# EasyEDA schematic SCH_AC400-Controller_2024-06-21.json
TITLE: Sheet_1; REV: 1.0; Date: 2021-10-31; Sheet: 1/1; Drawn By: Andrey Kharitonkin; Company: Your Company
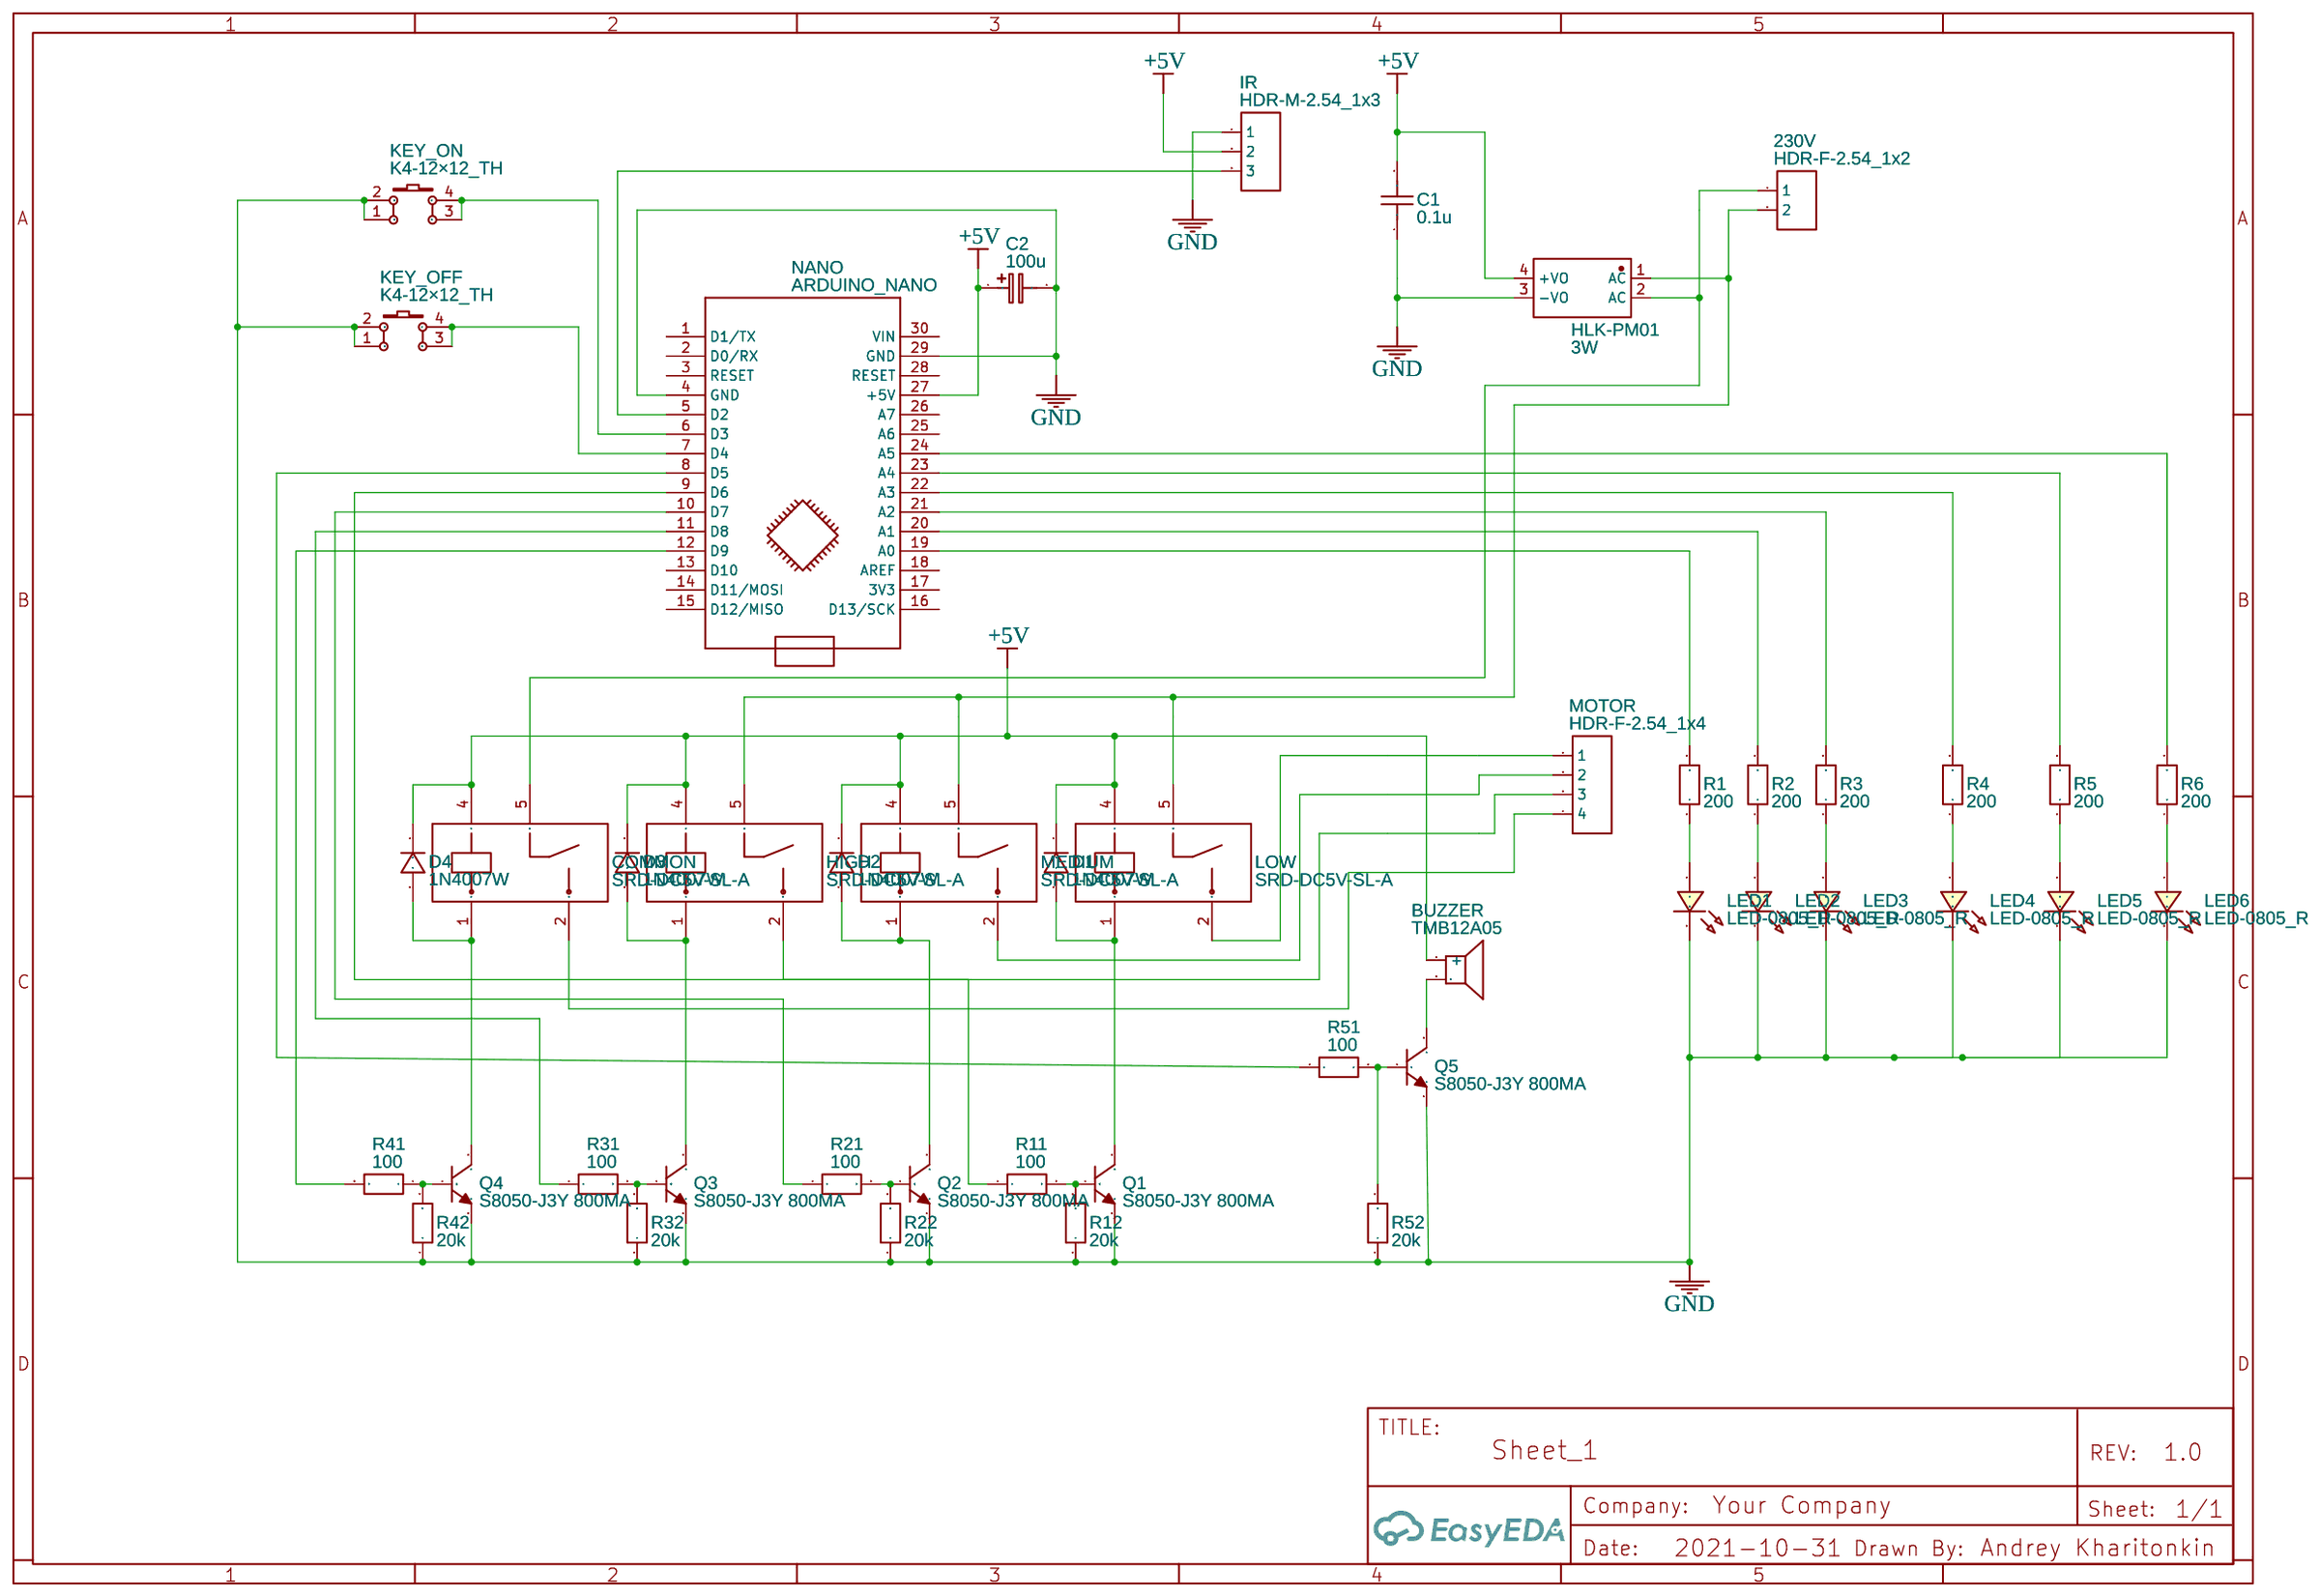
[diagram p0: schematic sheet]

## Parts
3W  HLK-PM01  [PWRM-TH_HLK-PM01]
230V  HDR-F-2.54_1x2  [CONN-TH_3(2)P-P3.96_B3PS-VH]
BUZZER  TMB12A05  [BUZ-TH_BD12.0-P7.60-D0.6-FD]
C1  0.1u  [C0805]
C2  100u  [CAP-D6.3×F2.5]
COMMON  SRD-DC5V-SL-A  [RELAY-TH_SRD-DCXXV-SL-A]
D1  1N4007W  [SOD-123_L2.8-W1.8-LS3.7-RD]
D2  1N4007W  [SOD-123_L2.8-W1.8-LS3.7-RD]
D3  1N4007W  [SOD-123_L2.8-W1.8-LS3.7-RD]
D4  1N4007W  [SOD-123_L2.8-W1.8-LS3.7-RD]
HIGH  SRD-DC5V-SL-A  [RELAY-TH_SRD-DCXXV-SL-A]
IR  HDR-M-2.54_1x3  [HDR-M-2.54_1X3]
KEY_OFF  K4-12×12_TH  [KEY-TH_4P-L12.0-W12.0-P5.00-LS12.5]
KEY_ON  K4-12×12_TH  [KEY-TH_4P-L12.0-W12.0-P5.00-LS12.5]
LED1  LED-0805_R  [LED1206-FD_GREEN]
LED2  LED-0805_R  [LED1206-FD_GREEN]
LED3  LED-0805_R  [LED1206-FD_GREEN]
LED4  LED-0805_R  [LED1206-FD_GREEN]
LED5  LED-0805_R  [LED1206-FD_GREEN]
LED6  LED-0805_R  [LED1206-FD_GREEN]
LOW  SRD-DC5V-SL-A  [RELAY-TH_SRD-DCXXV-SL-A]
MEDIUM  SRD-DC5V-SL-A  [RELAY-TH_SRD-DCXXV-SL-A]
MOTOR  HDR-F-2.54_1x4  [CONN-TH_7(4)P-P3.96_B3PS-VH]
NANO  ARDUINO_NANO  [ARDUINO_NANO]
Q1  S8050-J3Y 800MA  [SOT-23-3_L2.9-W1.6-P1.90-LS2.8-BR]
Q2  S8050-J3Y 800MA  [SOT-23-3_L2.9-W1.6-P1.90-LS2.8-BR]
Q3  S8050-J3Y 800MA  [SOT-23-3_L2.9-W1.6-P1.90-LS2.8-BR]
Q4  S8050-J3Y 800MA  [SOT-23-3_L2.9-W1.6-P1.90-LS2.8-BR]
Q5  S8050-J3Y 800MA  [SOT-23-3_L2.9-W1.6-P1.90-LS2.8-BR]
R1  200  [R0805]
R2  200  [R0805]
R3  200  [R0805]
R4  200  [R0805]
R5  200  [R0805]
R6  200  [R0805]
R11  100  [R0805]
R12  20k  [R0805]
R21  100  [R0805]
R22  20k  [R0805]
R31  100  [R0805]
R32  20k  [R0805]
R41  100  [R0805]
R42  20k  [R0805]
R51  100  [R0805]
R52  20k  [R0805]

## Library data of the parts
3W = HLK-PM01: Supplier: LCSC; Supplier Part: C209903; Manufacturer: HI-LINK; Contributor: LCSC; JLCPCB Part Class: Extended Part
230V = HDR-F-2.54_1x2: Supplier Part: C49661; Supplier: LCSC; Contributor: LCEDA_Lib
BUZZER = TMB12A05: Supplier: LCSC; Manufacturer: HNDZ; Supplier Part: C96093; JLCPCB Part Class: Extended Part
C1 = C_1206_US: Supplier Part: C126469; Supplier: LCSC; Contributor: LCEDA_Lib; Manufacturer Part: CT41G-0805-2X1-50V-0.1uF-K(N); Manufacturer: TORCH
C2 = CE_TH_D6.3×F2.5_EU: Contributor: LCEDA_Lib
COMMON HIGH LOW MEDIUM = SRD-DC5V-SL-A: Supplier: LCSC; Supplier Part: C688861; Manufacturer: Ningbo Songle Relay; Contributor: LCSC; JLCPCB Part Class: Extended Part
D1-D4 = 1N4007W: Supplier: LCSC; Supplier Part: C328592; Manufacturer: BLUE ROCKET; Contributor: LCEDA_Lib
IR = HDR-M-2.54_1x3: Supplier Part: C180248; Supplier: LCSC; Contributor: LCEDA_Lib
KEY_OFF KEY_ON = K4-12×12_TH: Supplier Part: C128053; Supplier: LCSC; Manufacturer: 韩国韩荣; Manufacturer Part: K2-1103DP-M4SW-04; Contributor: LCEDA_Lib
LED1-LED6 = LED-0805_R: Manufacturer: EVERLIGHT(台湾亿光); Manufacturer Part: 17-21SURC/S530-A3/TR8; Supplier Part: C72037; Contributor: LCEDA_Lib
MOTOR = HDR-F-2.54_1x4: Supplier Part: C225501; Supplier: LCSC; Contributor: LCEDA_Lib
NANO = -: sourceId: KGSeAWhDB; Manufacturer Part: ?
Q1-Q5 = S8050-J3Y 800MA: Supplier: LCSC; Supplier Part: C2848180; Manufacturer: IDCHIP(英锐芯); Contributor: LCSC
R1-R6 = R_0805_EU: Supplier Part: C17540; Supplier: LCSC; Contributor: LCEDA_Lib; Manufacturer Part: 0805W8F2000T5E; Manufacturer: UniOhm
R11 R12 R21 R22 R31 R32 R41 R42 R52 = R_0805_EU: Contributor: LCEDA_Lib
R51 = R_0805_EU: Supplier: LCSC; Contributor: LCEDA_Lib

## Nets
+5V: 3W.4(+VO) BUZZER.1(+) C1.2 C2.1 COMMON.4 D1.1 D2.1 D3.1 D4.1 HIGH.4 IR.2 LOW.4 MEDIUM.4 NANO.27(+5V)
GND: 3W.3(-VO) C1.1 C2.2 IR.1 KEY_OFF.1 KEY_OFF.2 KEY_ON.1 KEY_ON.2 LED1.2 LED2.2 LED3.2 LED4.2 LED5.2 LED6.2 NANO.4(GND) NANO.29(GND) Q1.2(E) Q2.2(E) Q3.2(E) Q4.2(E) Q5.2(E) R12.1 R22.1 R32.1 R42.1 R52.1
Net-(3W-1): 3W.1(AC) 230V.2 HIGH.5 LOW.5 MEDIUM.5
Net-(3W-2): 3W.2(AC) 230V.1 COMMON.5
Net-(BUZZER-2): BUZZER.2 Q5.3(C)
Net-(COMMON-1): COMMON.1 D4.2 Q4.3(C)
Net-(COMMON-2): COMMON.2 MOTOR.4
Net-(D1-2): D1.2 LOW.1 Q1.3(C)
Net-(D2-2): D2.2 MEDIUM.1 Q2.3(C)
Net-(D3-2): D3.2 HIGH.1 Q3.3(C)
Net-(HIGH-2): HIGH.2 MOTOR.3
Net-(IR-3): IR.3 NANO.5(D2)
Net-(KEY_OFF-3): KEY_OFF.3 KEY_OFF.4 NANO.7(D4)
Net-(KEY_ON-3): KEY_ON.3 KEY_ON.4 NANO.6(D3)
Net-(LED1-1): LED1.1 R1.1
Net-(LED2-1): LED2.1 R2.1
Net-(LED3-1): LED3.1 R3.1
Net-(LED4-1): LED4.1 R4.1
Net-(LED5-1): LED5.1 R5.1
Net-(LED6-1): LED6.1 R6.1
Net-(LOW-2): LOW.2 MOTOR.1
Net-(MEDIUM-2): MEDIUM.2 MOTOR.2
Net-(NANO-8): NANO.8(D5) R51.1
Net-(NANO-9): NANO.9(D6) R11.1
Net-(NANO-10): NANO.10(D7) R21.1
Net-(NANO-11): NANO.11(D8) R31.1
Net-(NANO-12): NANO.12(D9) R41.2
Net-(NANO-19): NANO.19(A0) R1.2
Net-(NANO-20): NANO.20(A1) R2.2
Net-(NANO-21): NANO.21(A2) R3.2
Net-(NANO-22): NANO.22(A3) R4.2
Net-(NANO-23): NANO.23(A4) R5.2
Net-(NANO-24): NANO.24(A5) R6.2
Net-(Q1-1): Q1.1(B) R11.2 R12.2
Net-(Q2-1): Q2.1(B) R21.2 R22.2
Net-(Q3-1): Q3.1(B) R31.2 R32.2
Net-(Q4-1): Q4.1(B) R41.1 R42.2
Net-(Q5-1): Q5.1(B) R51.2 R52.2

Not connected (* = marked no-connect by the designer): NANO 1(D1/TX) 2(D0/RX) 3(RESET) 13(D10) 14(D11/MOSI) 15(D12/MISO) 16(D13/SCK) 17(3V3) 18(AREF) 25(A6) 26(A7) 28(RESET) 30(VIN)
